# EAGLE design knittykitty (EAGLE 7.6.0)
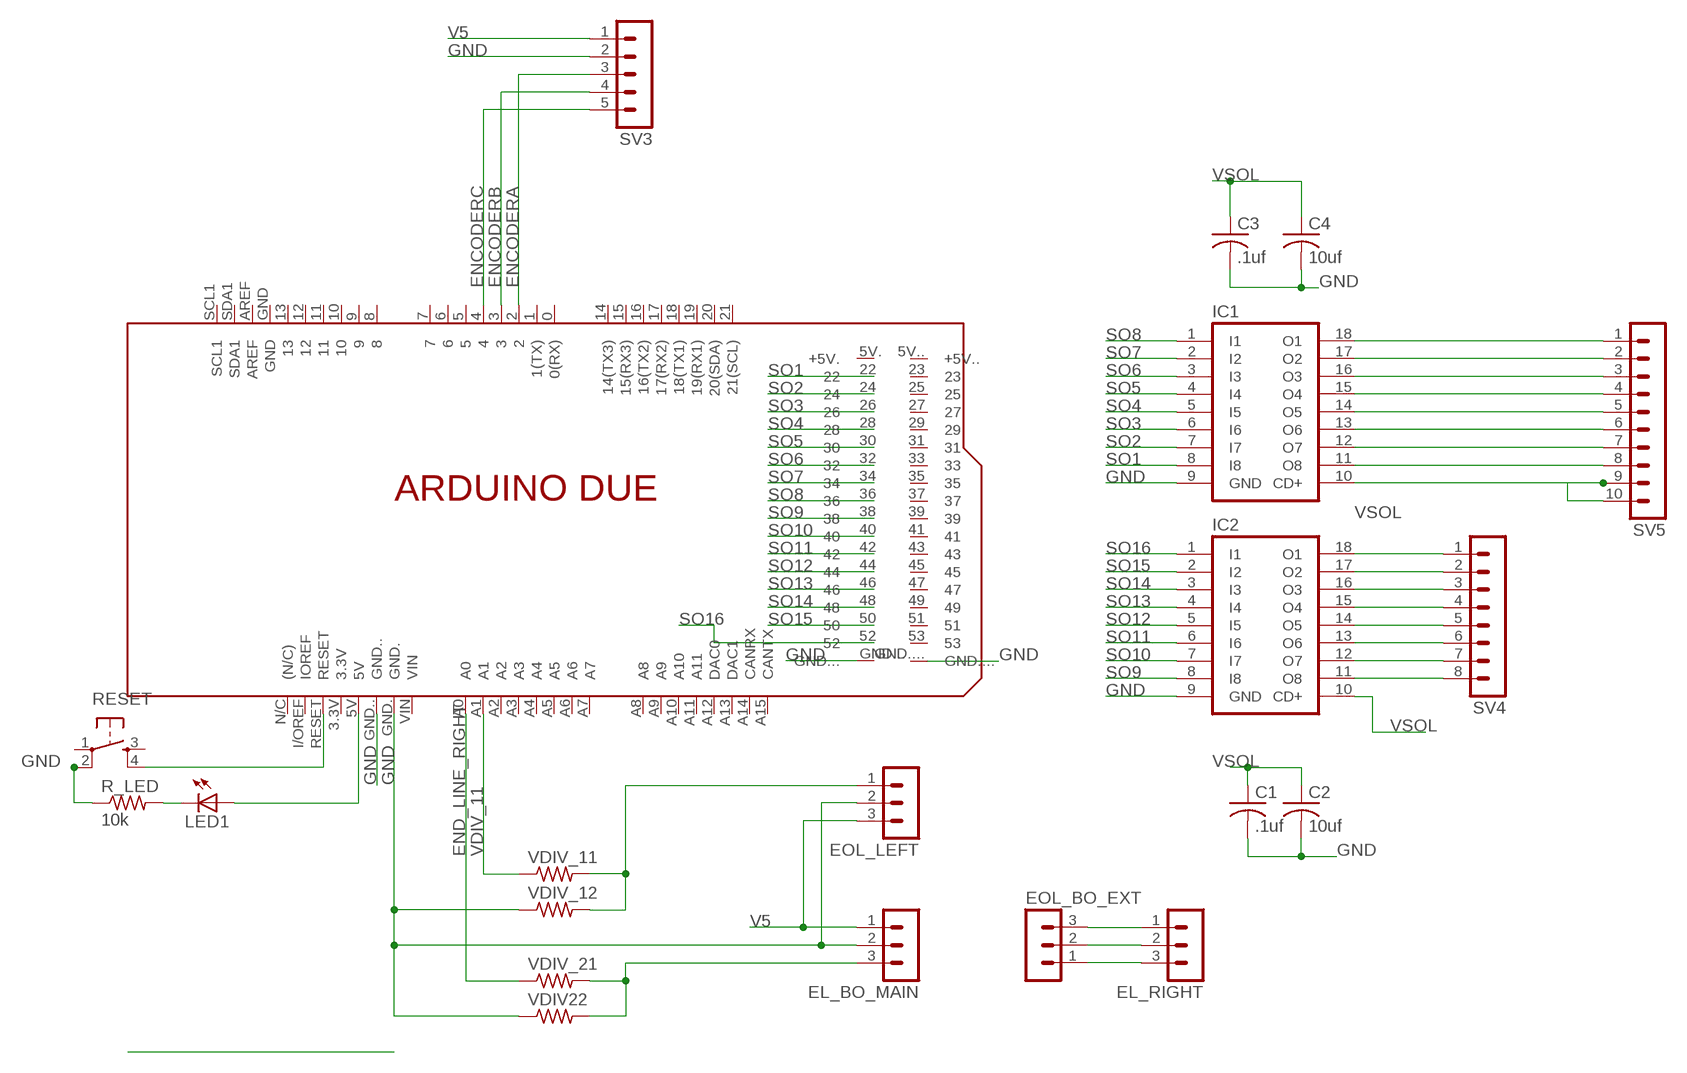
[diagram p0: schematic, sheet 1]

## Parts
C1  .1uf  C-USC1206  [C1206]
C2  10uf  C-USC1206  [C1206]
C3  .1uf  C-USC1206  [C1206]
C4  10uf  C-USC1206  [C1206]
EL_BO_MAIN  MA03-1  [MA03-1]
EL_RIGHT  MA03-1  [MA03-1]
EOL_BO_EXT  MA03-1  [MA03-1]
EOL_LEFT  MA03-1  [MA03-1]
IC1  ULN2803ASO  [SO18W]
IC2  ULN2803ASO  [SO18W]
LED1  LEDSMT1206  [1206]
PCB1  ARDUINO_DUE_MIN  [ARDUINO_DUE_MIN]
R_LED  10k  RES-US1206FAB  [R1206FAB]
RESET  6MM_SWITCH6MM_SWITCH  [6MM_SWITCH]
SV3  MA05-1  [MA05-1]
SV4  MA08-1  [MA08-1]
SV5  MA10-1  [MA10-1]
VDIV22  R-US_R1206  [R1206]
VDIV_11  R-US_R1206  [R1206]
VDIV_12  R-US_R1206  [R1206]
VDIV_21  R-US_R1206  [R1206]

## Nets
EL_BO_EXT: EL_RIGHT.1 EOL_BO_EXT.3
ENCODERA: PCB1.2 SV3.3
ENCODERB: PCB1.3 SV3.4
ENCODERC: PCB1.4 SV3.5
END_LINE_RIGHT: PCB1.A0 VDIV_21.1
GND: C1.2 C2.2 C3.2 C4.2 EL_BO_MAIN.2 EOL_LEFT.2 IC1.9(GND) IC2.9(GND) PCB1.GND. PCB1.GND.. R_LED.1 RESET.2(P1) SV3.2 VDIV22.1 VDIV_12.1
N$3: PCB1.RESET RESET.4(S1)
N$4: IC1.18(O1) SV5.1
N$5: IC2.18(O1) SV4.1
N$6: LED1.C R_LED.2
N$7: IC1.17(O2) SV5.2
N$8: IC1.16(O3) SV5.3
N$9: IC1.15(O4) SV5.4
N$10: IC1.14(O5) SV5.5
N$11: IC1.13(O6) SV5.6
N$12: IC1.12(O7) SV5.7
N$13: IC1.11(O8) SV5.8
N$14: IC2.17(O2) SV4.2
N$15: IC2.16(O3) SV4.3
N$16: IC2.15(O4) SV4.4
N$17: IC2.14(O5) SV4.5
N$18: IC2.13(O6) SV4.6
N$19: IC2.12(O7) SV4.7
N$20: IC2.11(O8) SV4.8
N$21: EOL_LEFT.1 VDIV_11.2 VDIV_12.2
N$22: EL_BO_MAIN.3 VDIV22.2 VDIV_21.2
N$24: EL_RIGHT.2 EOL_BO_EXT.2
N$25: EL_RIGHT.3 EOL_BO_EXT.1
SO1: IC1.8(I8) PCB1.22
SO2: IC1.7(I7) PCB1.24
SO3: IC1.6(I6) PCB1.26
SO4: IC1.5(I5) PCB1.28
SO5: IC1.4(I4) PCB1.30
SO6: IC1.3(I3) PCB1.32
SO7: IC1.2(I2) PCB1.34
SO8: IC1.1(I1) PCB1.36
SO9: IC2.8(I8) PCB1.38
SO10: IC2.7(I7) PCB1.40
SO11: IC2.6(I6) PCB1.42
SO12: IC2.5(I5) PCB1.44
SO13: IC2.4(I4) PCB1.46
SO14: IC2.3(I3) PCB1.48
SO15: IC2.2(I2) PCB1.50
SO16: IC2.1(I1) PCB1.52
V5: EL_BO_MAIN.1 EOL_LEFT.3 LED1.A PCB1.5V SV3.1
VDIV_11: PCB1.A1 VDIV_11.1
VSOL: C1.1 C2.1 C3.1 C4.1 IC1.10(CD+) IC2.10(CD+) SV5.9 SV5.10
Unconnected: PCB1.0(0(RX)) PCB1.1(1(TX)) PCB1.3.3V PCB1.5 PCB1.5V.(+5V.) PCB1.5V..(+5V..) PCB1.6 PCB1.7 PCB1.8 PCB1.9 PCB1.10 PCB1.11 PCB1.12 PCB1.13 PCB1.14(14(TX3)) PCB1.15(15(RX3)) PCB1.16(16(TX2)) PCB1.17(17(RX2)) PCB1.18(18(TX1)) PCB1.19(19(RX1)) PCB1.20(20(SDA)) PCB1.21(21(SCL)) PCB1.23 PCB1.25 PCB1.27 PCB1.29 PCB1.31 PCB1.33 PCB1.35 PCB1.37 PCB1.39 PCB1.41 PCB1.43 PCB1.45 PCB1.47 PCB1.49 PCB1.51 PCB1.53 PCB1.A2 PCB1.A3 PCB1.A4 PCB1.A5 PCB1.A6 PCB1.A7 PCB1.A8 PCB1.A9 PCB1.A10 PCB1.A11 PCB1.A12(DAC0) PCB1.A13(DAC1) PCB1.A14(CANRX) PCB1.A15(CANTX) PCB1.AREF PCB1.GND PCB1.GND... PCB1.GND.... PCB1.I/OREF(IOREF) PCB1.N/C((N/C)) PCB1.SCL1 PCB1.SDA1 PCB1.VIN RESET.1(P) RESET.3(S)

## Library data of the parts
C1-C4 = resistor:C-US: CAPACITOR, American symbol
EL_BO_MAIN EL_RIGHT EOL_BO_EXT EOL_LEFT = con-lstb:MA03-1: PIN HEADER; OC_FARNELL: unknown; OC_NEWARK: unknown
IC1 IC2 = zoilo:ULN2803A: DRIVER ARRAY
LED1 = adafruit:LED: LED OSRAM: - CHIPLED LG R971, LG N971, LY N971, LG Q971, LY Q971, LO R971, LY R971 LH N974, LH R974 LS Q976, LO Q976, LY Q976 LO Q996 - Hyper CHIPLED LW Q18S LB Q993, LB Q99A, LB R99A - SideLED LS A670, LO A670, LY A670, LG A670, LP A670 LB A673, LV A673, LT A673, LW A673 LH A674 LY A675 LS A676, LA A676, LO A676, LY A676, LW A676 LS A679, LY A679, LG A679 - Hyper Micro SIDELED® LS Y876, LA Y876, LO Y876, LY Y876 LT Y87S - SmartLED LW L88C, LW L88S LB L89C, LB L89S, LG L890 LS L89K, LO L89K, LY L89K LS L896, LA L896, LO L896, LY L896 - TOPLED LS T670, LO T670, LY T670, LG T670, LP T670 LSG T670, LSP T670, LSY T670, LOP T670, LYG T670 LG T671, LOG T671, LSG T671 LB T673, LV T673, LT T673, LW T673 LH T674 LS T676, LA T676, LO T676, LY T676, LB T676, LH T676, LSB T676, LW T676 LB T67C, LV T67C, LT T67C, LS T67K, LO T67K, LY T67K, LW E67C LS E67B, LA E67B, LO E67B, LY E67B, LB E67C, LV E67C, LT E67C LW T67C LS T679, LY T679, LG T679 LS T770, LO T770, LY T770, LG T770, LP T770 LB T773, LV T773, LT T773, LW T773 LH T774 LS E675, LA E675, LY E675, LS T675 LS T776, LA T776, LO T776, LY T776, LB T776 LHGB T686 LT T68C, LB T68C - Hyper Mini TOPLED® LB M676 - Mini TOPLED Santana® LG M470 LS M47K, LO M47K, LY M47K Source: http://www.osram.convergy.de/
PCB1 = E14_Arduino_revB:ARDUINO_DUE_MIN
R_LED = fab:RES-US: Resistor (US Symbol) Variants with postfix FAB are widened to allow the routing of internal traces
RESET = fab:6MM_SWITCH: OMRON SWITCH
SV3 = con-lstb:MA05-1: PIN HEADER; OC_FARNELL: unknown; OC_NEWARK: unknown
SV4 = con-lstb:MA08-1: PIN HEADER; OC_FARNELL: unknown; OC_NEWARK: unknown
SV5 = con-lstb:MA10-1: PIN HEADER; OC_FARNELL: unknown; OC_NEWARK: unknown
VDIV22 VDIV_11 VDIV_12 VDIV_21 = resistor:R-US_: RESISTOR, American symbol

## Board
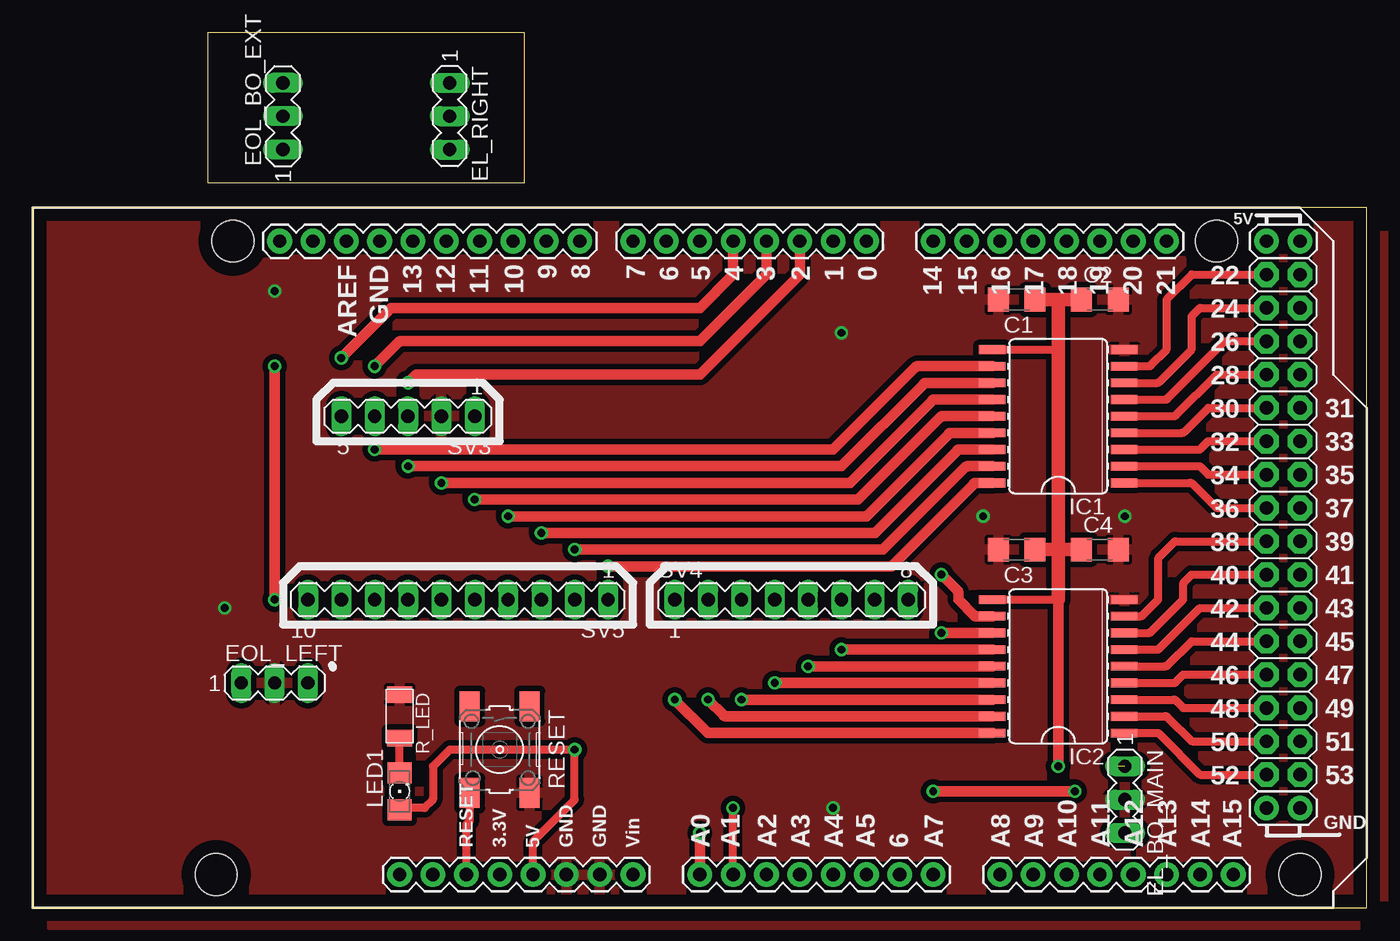
[diagram p1: board, top side]
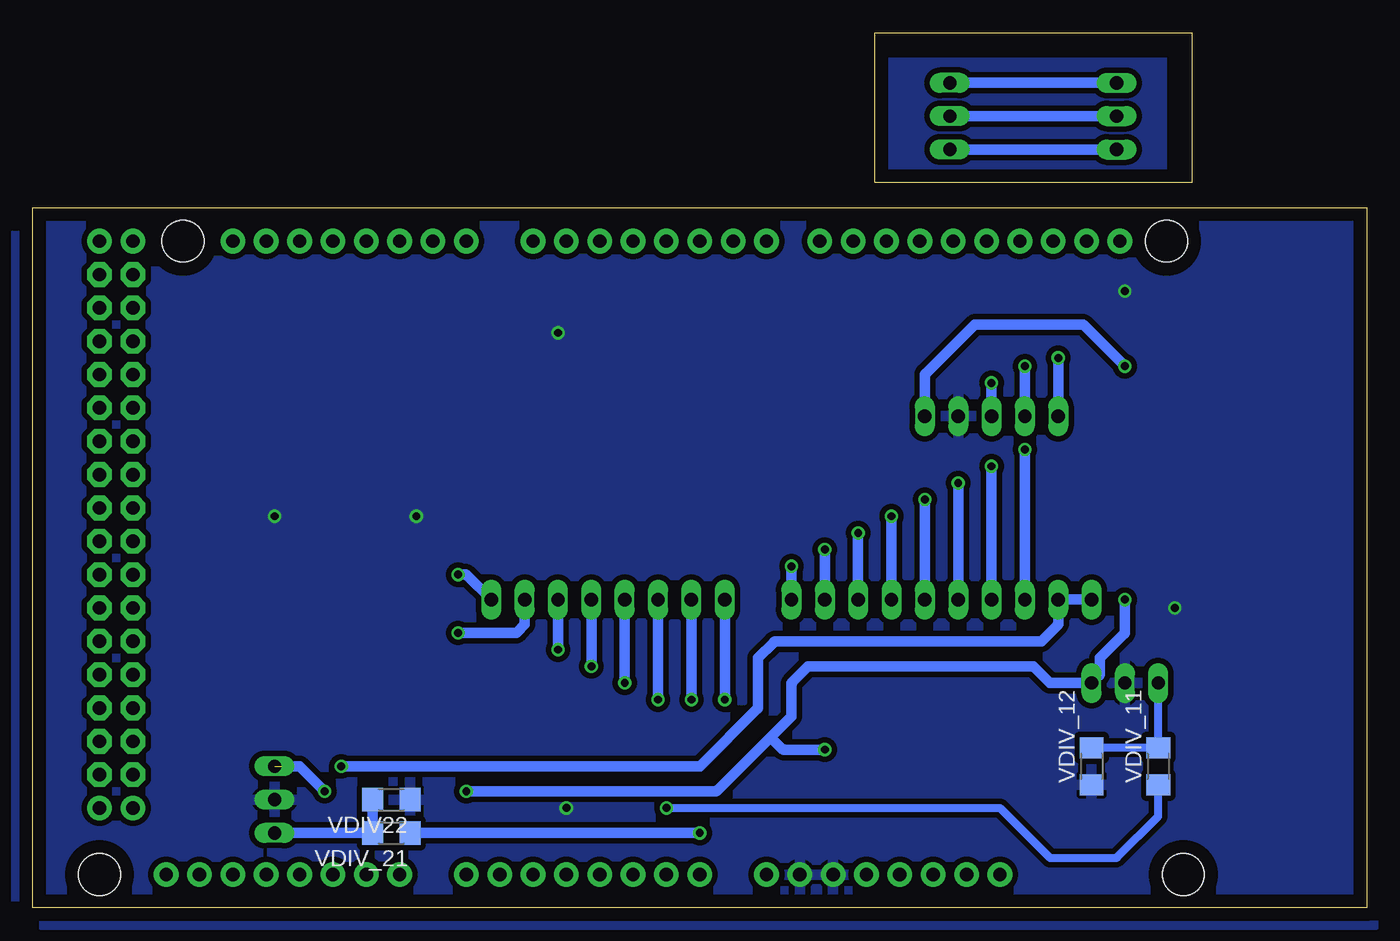
[diagram p2: board, bottom side, seen from below]

Size 101.6 x 66.67 mm. Coordinates in mm from the lower left corner, seen from the top.
Outline: 13.34,66.67 13.34,55.24 37.47,55.24 37.47,66.67 13.34,66.67
Outline: 0,53.34 0,0 101.6,0 101.6,53.34 0,53.34
Copper layers (1*16): Top 0.035mm / dielectric 1.5mm / Bottom 0.035mm
Design rules "fabmodule": minimum track width 10mil, minimum drill 0.4mm, track to track 0.42mm, track to pad 0.42mm, pad to pad 0.42mm, via to via 0.42mm, smd to smd 0.42mm, copper to edge 40mil, drill to drill 0.8mm, minimum pad ring 10mil, minimum via ring 8mil, stop-mask expansion 4mil, vias tented up to drill 0mil, thermal gap 10mil

### Footprints (pad centres in the part's own frame; a part is rotated, then mirrored left to right if it is on the bottom)
C1206 = smd 1.6 x 1.8: 1 -1.4,0; 2 1.4,0
MA03-1 = drill 1.016 long: 1 -2.54,0; 2 0,0; 3 2.54,0
SO18W = smd 0.66 x 2.032: 1 -5.08,-5.029; 2 -3.81,-5.029; 3 -2.54,-5.029; 4 -1.27,-5.029; 5 0,-5.029; 6 1.27,-5.029; 7 2.54,-5.029; 8 3.81,-5.029; 9 5.08,-5.029; 10 5.08,5.029; 11 3.81,5.029; 12 2.54,5.029; 13 1.27,5.029; 14 0,5.029; 15 -1.27,5.029; 16 -2.54,5.029; 17 -3.81,5.029; 18 -5.08,5.029
1206 = smd 1.6 x 1.803: A -1.422,0; C 1.422,0
ARDUINO_DUE_MIN = drill 1.016 pad 1.88: 0 35.56,24.13; 1 33.02,24.13; 2 30.48,24.13; 3 27.94,24.13; 3.3V 7.62,-24.13; 4 25.4,24.13; 5 22.86,24.13; 5V 10.16,-24.13; 5V. 66.04,24.13; 5V.. 68.58,24.13; 6 20.32,24.13; 7 17.78,24.13; 8 13.716,24.13; 9 11.176,24.13; 10 8.636,24.13; 11 6.096,24.13; 12 3.556,24.13; 13 1.016,24.13; 14 40.64,24.13; 15 43.18,24.13; 16 45.72,24.13; 17 48.26,24.13; 18 50.8,24.13; 19 53.34,24.13; 20 55.88,24.13; 21 58.42,24.13; A0 22.86,-24.13; A1 25.4,-24.13; A2 27.94,-24.13; A3 30.48,-24.13; A4 33.02,-24.13; A5 35.56,-24.13; A6 38.1,-24.13; A7 40.64,-24.13; A8 45.72,-24.13; A9 48.26,-24.13; A10 50.8,-24.13; A11 53.34,-24.13; A12 55.88,-24.13; A13 58.42,-24.13; A14 60.96,-24.13; A15 63.5,-24.13; AREF -4.064,24.13; GND -1.524,24.13; GND. 15.24,-24.13; GND.. 12.7,-24.13; GND... 66.04,-19.05; GND.... 68.58,-19.05; I/OREF 2.54,-24.13; N/C 0,-24.13; RESET 5.08,-24.13; SCL1 -9.144,24.13; SDA1 -6.604,24.13; VIN 17.78,-24.13 | drill 1.016 pad 1.88 octagon: 22 66.04,21.59; 23 68.58,21.59; 24 66.04,19.05; 25 68.58,19.05; 26 66.04,16.51; 27 68.58,16.51; 28 66.04,13.97; 29 68.58,13.97; 30 66.04,11.43; 31 68.58,11.43; 32 66.04,8.89; 33 68.58,8.89; 34 66.04,6.35; 35 68.58,6.35; 36 66.04,3.81; 37 68.58,3.81; 38 66.04,1.27; 39 68.58,1.27; 40 66.04,-1.27; 41 68.58,-1.27; 42 66.04,-3.81; 43 68.58,-3.81; 44 66.04,-6.35; 45 68.58,-6.35; 46 66.04,-8.89; 47 68.58,-8.89; 48 66.04,-11.43; 49 68.58,-11.43; 50 66.04,-13.97; 51 68.58,-13.97; 52 66.04,-16.51; 53 68.58,-16.51 | hole 3.2: -12.7,24.13; -13.97,-24.13; 62.23,24.13; 68.58,-24.13
R1206FAB = smd 1.27 x 1.905: 1 -1.651,0; 2 1.651,0
6MM_SWITCH = smd 2.286 x 1.524: 1 -3.302,2.286; 2 3.302,2.286; 3 -3.302,-2.286; 4 3.302,-2.286
MA05-1 = drill 1.016 long: 1 -5.08,0; 2 -2.54,0; 3 0,0; 4 2.54,0; 5 5.08,0
MA08-1 = drill 1.016 long: 1 -8.89,0; 2 -6.35,0; 3 -3.81,0; 4 -1.27,0; 5 1.27,0; 6 3.81,0; 7 6.35,0; 8 8.89,0
MA10-1 = drill 1.016 long: 1 -11.43,0; 2 -8.89,0; 3 -6.35,0; 4 -3.81,0; 5 -1.27,0; 6 1.27,0; 7 3.81,0; 8 6.35,0; 9 8.89,0; 10 11.43,0
R1206 = smd 1.6 x 1.803: 1 -1.422,0; 2 1.422,0

### Placement (x,y rotation side)
C1  74.93,46.35 180 top
C2  81.28,46.35 0 top
C3  74.93,27.3 180 top
C4  81.28,27.3 0 top
EL_BO_MAIN  83.19,8.25 270 top
EL_RIGHT  31.75,60.33 270 top
EOL_BO_EXT  19.05,60.33 90 top
EOL_LEFT  18.41,17.14 0 top
IC1  78.11,37.46 90 top
IC2  78.11,18.42 90 top
LED1  27.94,8.89 90 top
PCB1  27.94,26.67 0 top
R_LED  27.94,14.6 270 top
RESET  35.56,12.06 270 top
SV3  28.58,37.46 180 top
SV4  57.78,23.5 0 top
SV5  32.38,23.5 180 top
VDIV22  74.3,8.25 180 bottom
VDIV_11  15.88,10.79 90 bottom
VDIV_12  20.96,10.79 90 bottom
VDIV_21  74.3,5.71 180 bottom

### Tracks (layer width: path | path; a pad name or v marks a point on that pad's centre or on a via)
EL_BO_EXT
  Bottom 0.813: EOL_BO_EXT.3 EL_RIGHT.1
ENCODERA  (via drill 0.6)
  Top 0.813: PCB1.2 58.42,48.36 arc-45 58.35,48.19 50.8,40.64 29.32,40.64 arc45 29.14,40.57 v28.58,40
  Bottom 0.813: v28.58,40 SV3.3
ENCODERB  (via drill 0.6)
  Top 0.813: PCB1.3 55.88,48.36 arc-45 55.81,48.19 50.8,43.18 28.05,43.18 arc45 27.87,43.11 v26.04,41.27
  Bottom 0.813: v26.04,41.27 SV3.4
ENCODERC  (via drill 0.6)
  Top 0.813: PCB1.4 53.34,48.36 arc-45 53.27,48.19 50.8,45.72 27.41,45.72 arc45 27.23,45.65 v23.5,41.91
  Bottom 0.813: v23.5,41.91 SV3.5
END_LINE_RIGHT  (via drill 0.6)
  Top 0.813: PCB1.A0 v50.8,5.71
  Bottom 0.813: v50.8,5.71 VDIV_21.1
GND  (via drill 0.6)
  other vias: 18.41,46.99 14.61,22.86 60.96,7.62 61.59,43.81 72.39,29.85 83.19,29.85
  pour Bottom: -0.63,53.97 -0.63,-1.27 100.86,-1.27 arc45 101.04,-1.2 102.87,0.64 102.87,51.33 arc45 102.8,51.51 100.33,53.97
  pour Top: 1.27,53.97 1.27,-1.27 100.86,-1.27 arc45 101.04,-1.2 102.87,0.64 102.87,51.33 arc45 102.8,51.51 100.33,53.97
N$3
  Top 0.61: RESET.4 33.27,6.71 arc-45 33.2,6.53 33.02,6.35 PCB1.RESET
N$4  (via drill 0.6)
  Top 0.813: IC1.18 71.86,32.38 arc45 71.68,32.31 65.41,26.04 v43.81,26.04
  Bottom 0.813: v43.81,26.04 SV5.1
N$5  (via drill 0.6)
  Top 0.813: IC2.18 51.54,13.33 arc-45 51.36,13.41 v48.89,15.87
  Bottom 0.813: v48.89,15.87 SV4.1
N$6
  Top 0.61: LED1.C R_LED.2
N$7  (via drill 0.6)
  Top 0.813: IC1.17 71.23,33.66 arc45 71.05,33.58 64.77,27.3 v41.27,27.3
  Bottom 0.813: v41.27,27.3 SV5.2
N$8  (via drill 0.6)
  Top 0.813: IC1.16 70.59,34.92 arc45 70.41,34.85 64.14,28.57 v38.73,28.57
  Bottom 0.813: v38.73,28.57 SV5.3
N$9  (via drill 0.6)
  Top 0.813: IC1.15 69.95,36.2 arc45 69.78,36.12 63.5,29.85 v36.2,29.85
  Bottom 0.813: v36.2,29.85 SV5.4
N$10  (via drill 0.6)
  Top 0.813: IC1.14 69.32,37.46 arc45 69.14,37.39 62.87,31.11 v33.66,31.11
  Bottom 0.813: v33.66,31.11 SV5.5
N$11  (via drill 0.6)
  Top 0.813: IC1.13 68.69,38.73 arc45 68.51,38.66 62.23,32.38 v31.12,32.38
  Bottom 0.813: v31.12,32.38 SV5.6
N$12  (via drill 0.6)
  Top 0.813: IC1.12 68.05,40 arc45 67.87,39.93 61.59,33.66 v28.58,33.66
  Bottom 0.813: v28.58,33.66 SV5.7
N$13  (via drill 0.6)
  Top 0.813: IC1.11 67.42,41.27 arc45 67.24,41.2 60.96,34.92 v26.04,34.92
  Bottom 0.813: v26.04,34.92 SV5.8
N$14  (via drill 0.6)
  Top 0.813: IC2.17 52.81,14.6 arc-45 52.63,14.68 v51.44,15.87
  Bottom 0.813: v51.44,15.87 SV4.2
N$15  (via drill 0.6)
  Top 0.813: IC2.16 v53.98,15.87
  Bottom 0.813: v53.98,15.87 SV4.3
N$16  (via drill 0.6)
  Top 0.813: IC2.15 v56.52,17.14
  Bottom 0.813: v56.52,17.14 SV4.4
N$17  (via drill 0.6)
  Top 0.813: IC2.14 v59.05,18.42
  Bottom 0.813: v59.05,18.42 SV4.5
N$18  (via drill 0.6)
  Top 0.813: IC2.13 v61.59,19.69
  Bottom 0.813: v61.59,19.69 SV4.6
N$19  (via drill 0.6)
  Top 0.813: IC2.12 v69.22,20.96
  Bottom 0.813: v69.22,20.96 64.88,20.96 arc-45 64.7,21.03 64.14,21.59 SV4.7
N$20  (via drill 0.6)
  Top 0.813: IC2.11 71.86,22.23 arc-45 71.68,22.3 70.48,23.5 70.48,24.03 arc45 70.41,24.2 v69.22,25.4
  Bottom 0.813: v69.22,25.4 68.69,25.4 arc45 68.51,25.33 SV4.8
N$21
  Bottom 0.61: EOL_LEFT.1 VDIV_11.2 VDIV_12.2
N$22
  Bottom 0.813: VDIV_21.2 VDIV22.2 75.72,5.97 arc-45 75.64,5.79 75.56,5.71 EL_BO_MAIN.3
N$23
  pour Bottom: 15.24,55.88 37.47,55.88 37.47,64.66 arc45 37.39,64.84 36.2,64.77 15.24,64.77
N$24
  Bottom 0.813: EOL_BO_EXT.2 EL_RIGHT.2
N$25
  Bottom 0.813: EOL_BO_EXT.1 EL_RIGHT.3
SO1
  Top 0.61: IC1.8 84.98,41.27 arc45 85.16,41.35 86.36,42.54 86.36,46.25 arc-45 86.43,46.43 88.27,48.26 PCB1.22
SO2
  Top 0.61: IC1.7 85.62,40 arc45 85.8,40.08 88.27,42.54 88.27,44.98 arc-45 88.34,45.16 88.9,45.72 PCB1.24
SO3
  Top 0.61: IC1.6 86.25,38.73 arc45 86.43,38.81 90.8,43.18 PCB1.26
SO4
  Top 0.61: IC1.5 86.89,37.46 arc45 87.07,37.54 90.17,40.64 PCB1.28
SO5
  Top 0.61: IC1.4 87.53,36.2 arc45 87.7,36.27 89.53,38.1 PCB1.30
SO6
  Top 0.61: IC1.3 88.8,34.92 arc45 88.97,35 89.53,35.56 PCB1.32
SO7
  Top 0.61: IC1.2 88.8,33.66 arc-45 88.97,33.58 89.53,33.02 PCB1.34
SO8
  Top 0.61: IC1.1 88.16,32.38 arc-45 88.34,32.31 90.17,30.48 PCB1.36
SO9
  Top 0.61: IC2.8 84.35,22.23 arc45 84.53,22.3 85.72,23.5 85.72,26.57 arc-45 85.8,26.74 87,27.94 PCB1.38
SO10
  Top 0.61: IC2.7 84.98,20.96 arc45 85.16,21.03 87.63,23.5 87.63,24.66 arc-45 87.7,24.84 88.27,25.4 PCB1.40
SO11
  Top 0.61: IC2.6 85.62,19.69 arc45 85.8,19.76 88.9,22.86 PCB1.42
SO12
  Top 0.61: IC2.5 86.25,18.42 arc45 86.43,18.49 88.27,20.32 PCB1.44
SO13
  Top 0.61: IC2.4 86.89,17.14 arc45 87.07,17.22 87.63,17.78 PCB1.46
SO14
  Top 0.61: IC2.3 86.89,15.87 arc-45 87.07,15.8 87.63,15.24 PCB1.48
SO15
  Top 0.61: IC2.2 86.25,14.6 arc-45 86.43,14.53 88.27,12.7 PCB1.50
SO16
  Top 0.61: IC2.1 85.62,13.33 arc-45 85.8,13.26 88.9,10.16 PCB1.52
V5  (via drill 0.6)  (1 unrouted)
  Top 0.61: PCB1.5V 38.1,4.97 arc-45 38.17,5.15 41.27,8.25 v41.27,12.06 31.86,12.06 arc45 31.68,11.99 30.48,10.79 30.48,8.36 arc-45 30.41,8.18 29.84,7.62 28.2,7.62 arc45 28.02,7.55 LED1.A
  Top 0.813: v18.41,41.27 v18.41,23.5 | v68.58,8.89 v79.38,8.89
  Bottom 0.813: 82.66,10.79 arc45 82.48,10.72 | 45.4,13.02 49.46,8.96 arc45 49.63,8.89 v68.58,8.89 | 45.4,13.02 43.81,14.6 43.81,17.04 arc45 43.74,17.22 42.55,18.42 25.51,18.42 arc45 25.33,18.34 24.13,17.14 EOL_LEFT.3 20.39,17.71 arc-45 20.32,17.89 20.32,19.05 18.49,20.88 arc-45 18.41,21.06 v18.41,23.5 | v41.27,12.06 44.34,12.06 arc45 44.52,12.14 45.4,13.02 | SV3.1 33.66,40.53 arc45 33.58,40.71 29.84,44.45 21.7,44.45 arc45 21.52,44.38 v18.41,41.27 | v79.38,8.89 81.28,10.79 EL_BO_MAIN.1
VDIV_11  (via drill 0.6)
  Top 0.61: PCB1.A1 v53.34,7.62
  Bottom 0.61: v53.34,7.62 28.05,7.62 arc45 27.87,7.55 24.13,3.81 19.16,3.81 arc-45 18.98,3.88 15.88,6.98 VDIV_11.1
VSOL  (via drill 0.6)
  Top 0.61: IC2.10 78.11,23.5 | IC1.10 78.11,42.54
  Top 0.813: v78.11,10.79 78.11,24.13
  Top 1.016: 78.11,27.3 C4.1 | C2.1 78.11,46.35 | 78.11,46.35 C1.1 | 78.11,27.3 78.11,42.54 78.11,46.35 | C3.1 78.11,27.3 | 78.11,27.3 78.11,24.13 78.11,23.5
  Bottom 0.813: SV5.10 SV5.9 23.5,21.7 arc45 23.57,21.52 24.77,20.32 44.98,20.32 arc-45 45.16,20.25 46.35,19.05 46.35,15.35 arc45 46.43,15.17 50.8,10.79 v78.11,10.79